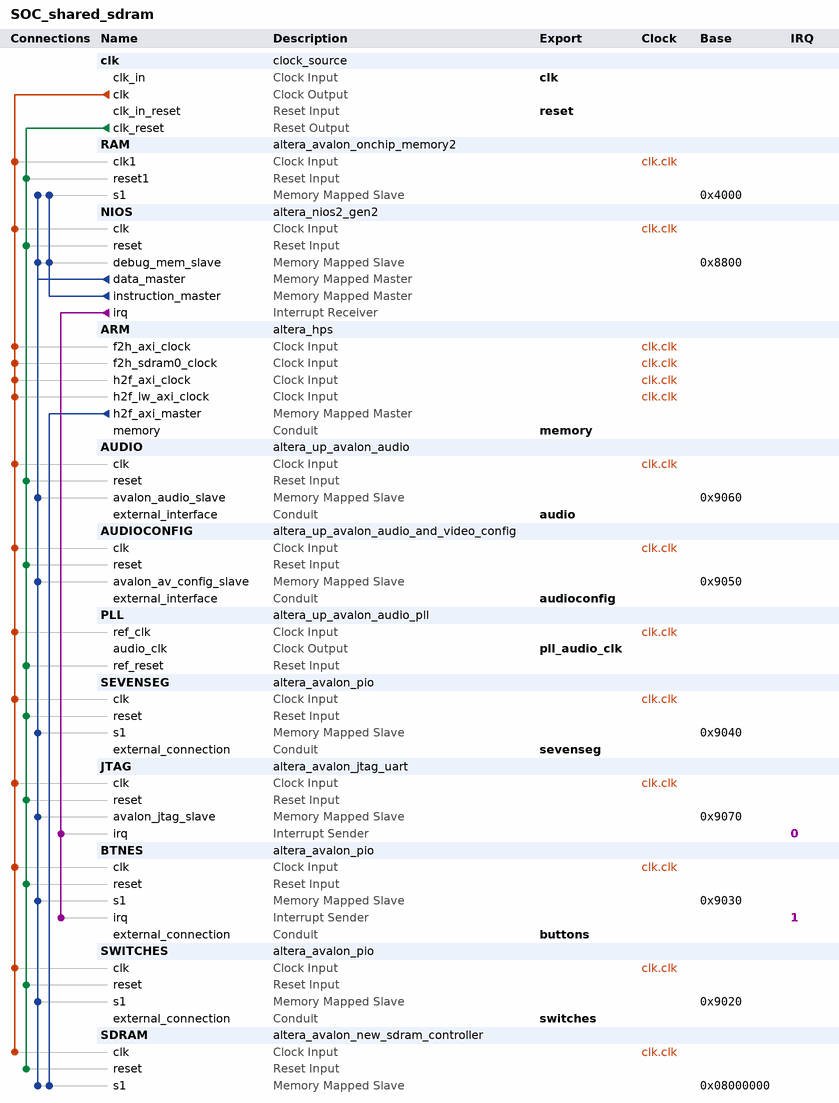
[diagram p0: system contents]
# Platform Designer (Qsys) system SOC_shared_sdram, Cyclone V 5CSEMA5F31C6
# Parameters at their usual value, and those the tool derives, are not listed.
package require -exact qsys 18.1
create_system SOC_shared_sdram
set_project_property DEVICE_FAMILY {Cyclone V}
set_project_property DEVICE 5CSEMA5F31C6

add_instance clk clock_source 18.1
set_instance_parameter_value clk clockFrequency 50000000

add_instance RAM altera_avalon_onchip_memory2 18.1
set_instance_parameter_value RAM dataWidth 32
set_instance_parameter_value RAM dualPort false
set_instance_parameter_value RAM initMemContent true
set_instance_parameter_value RAM initializationFileName onchip_mem.hex
set_instance_parameter_value RAM memorySize 16384

add_instance NIOS altera_nios2_gen2 18.1
set_instance_parameter_value NIOS dcache_size 2048
set_instance_parameter_value NIOS exceptionSlave RAM.s1
set_instance_parameter_value NIOS icache_size 4096
set_instance_parameter_value NIOS impl Tiny
set_instance_parameter_value NIOS resetSlave RAM.s1

add_instance ARM altera_hps 18.1
set_instance_parameter_value ARM EMAC1_Mode N/A
set_instance_parameter_value ARM EMAC1_PinMuxing Unused
set_instance_parameter_value ARM F2SCLK_COLDRST_Enable false
set_instance_parameter_value ARM F2SCLK_DBGRST_Enable false
set_instance_parameter_value ARM F2SCLK_WARMRST_Enable false
set_instance_parameter_value ARM F2SDRAM_Type AXI-3
set_instance_parameter_value ARM F2SDRAM_Width 64
set_instance_parameter_value ARM F2SINTERRUPT_Enable false
set_instance_parameter_value ARM F2S_Width 2
set_instance_parameter_value ARM FPGA_PERIPHERAL_OUTPUT_CLOCK_FREQ_EMAC0_GTX_CLK 125
set_instance_parameter_value ARM FPGA_PERIPHERAL_OUTPUT_CLOCK_FREQ_EMAC0_MD_CLK 2.5
set_instance_parameter_value ARM FPGA_PERIPHERAL_OUTPUT_CLOCK_FREQ_EMAC1_GTX_CLK 125
set_instance_parameter_value ARM FPGA_PERIPHERAL_OUTPUT_CLOCK_FREQ_EMAC1_MD_CLK 2.5
set_instance_parameter_value ARM HPS_PROTOCOL DDR3
set_instance_parameter_value ARM I2C0_Mode N/A
set_instance_parameter_value ARM I2C0_PinMuxing Unused
set_instance_parameter_value ARM I2C1_Mode N/A
set_instance_parameter_value ARM I2C1_PinMuxing Unused
set_instance_parameter_value ARM LWH2F_Enable true
set_instance_parameter_value ARM MEM_BANKADDR_WIDTH 3
set_instance_parameter_value ARM MEM_CLK_FREQ 300.0
set_instance_parameter_value ARM MEM_CLK_FREQ_MAX 400.0
set_instance_parameter_value ARM MEM_COL_ADDR_WIDTH 8
set_instance_parameter_value ARM MEM_DQ_WIDTH 8
set_instance_parameter_value ARM MEM_DRV_STR RZQ/6
set_instance_parameter_value ARM MEM_ROW_ADDR_WIDTH 12
set_instance_parameter_value ARM MEM_RTT_NOM {ODT Disabled}
set_instance_parameter_value ARM MEM_RTT_WR {Dynamic ODT off}
set_instance_parameter_value ARM MEM_TCL 7
set_instance_parameter_value ARM MEM_TFAW_NS 37.5
set_instance_parameter_value ARM MEM_TINIT_US 499
set_instance_parameter_value ARM MEM_TMRD_CK 3
set_instance_parameter_value ARM MEM_TRAS_NS 40.0
set_instance_parameter_value ARM MEM_TRCD_NS 15.0
set_instance_parameter_value ARM MEM_TREFI_US 7.0
set_instance_parameter_value ARM MEM_TRFC_NS 75.0
set_instance_parameter_value ARM MEM_TRP_NS 15.0
set_instance_parameter_value ARM MEM_TWTR 2
set_instance_parameter_value ARM MEM_VENDOR JEDEC
set_instance_parameter_value ARM MEM_WTCL 6
set_instance_parameter_value ARM MPU_EVENTS_Enable true
set_instance_parameter_value ARM QSPI_Mode N/A
set_instance_parameter_value ARM QSPI_PinMuxing Unused
set_instance_parameter_value ARM REF_CLK_FREQ 125.0
set_instance_parameter_value ARM S2FCLK_USER2CLK 5
set_instance_parameter_value ARM S2F_Width 2
set_instance_parameter_value ARM SDIO_Mode N/A
set_instance_parameter_value ARM SDIO_PinMuxing Unused
set_instance_parameter_value ARM SPIM1_Mode N/A
set_instance_parameter_value ARM SPIM1_PinMuxing Unused
set_instance_parameter_value ARM STM_Enable false
set_instance_parameter_value ARM TIMING_BOARD_AC_SKEW 0.02
set_instance_parameter_value ARM TIMING_BOARD_AC_TO_CK_SKEW 0.0
set_instance_parameter_value ARM TIMING_BOARD_DQ_TO_DQS_SKEW 0.0
set_instance_parameter_value ARM TIMING_BOARD_MAX_CK_DELAY 0.6
set_instance_parameter_value ARM TIMING_BOARD_MAX_DQS_DELAY 0.6
set_instance_parameter_value ARM TIMING_BOARD_SKEW_BETWEEN_DQS 0.02
set_instance_parameter_value ARM TIMING_BOARD_SKEW_CKDQS_DIMM_MAX 0.01
set_instance_parameter_value ARM TIMING_BOARD_SKEW_CKDQS_DIMM_MIN -0.01
set_instance_parameter_value ARM TIMING_BOARD_SKEW_WITHIN_DQS 0.02
set_instance_parameter_value ARM TIMING_TDH 125
set_instance_parameter_value ARM TIMING_TDQSCK 400
set_instance_parameter_value ARM TIMING_TDQSQ 120
set_instance_parameter_value ARM TIMING_TDS 50
set_instance_parameter_value ARM TIMING_TIH 250
set_instance_parameter_value ARM TIMING_TIS 175
set_instance_parameter_value ARM TIMING_TQSH 0.38
set_instance_parameter_value ARM UART0_Mode N/A
set_instance_parameter_value ARM UART0_PinMuxing Unused
set_instance_parameter_value ARM USB1_Mode N/A
set_instance_parameter_value ARM USB1_PinMuxing Unused
set_instance_parameter_value ARM desired_cfg_clk_mhz 100.0
set_instance_parameter_value ARM desired_qspi_clk_mhz 400.0

add_instance AUDIO altera_up_avalon_audio 18.0
set_instance_parameter_value AUDIO audio_in true
set_instance_parameter_value AUDIO avalon_bus_type {Memory Mapped}
set_instance_parameter_value AUDIO dw 32

add_instance AUDIOCONFIG altera_up_avalon_audio_and_video_config 18.0
set_instance_parameter_value AUDIOCONFIG audio_in {Microphone to ADC}
set_instance_parameter_value AUDIOCONFIG bit_length 32
set_instance_parameter_value AUDIOCONFIG board DE1-SoC
set_instance_parameter_value AUDIOCONFIG line_in_bypass false
set_instance_parameter_value AUDIOCONFIG sampling_rate {48 kHz}

add_instance PLL altera_up_avalon_audio_pll 18.0
set_instance_parameter_value PLL audio_clk_freq 18.432
set_instance_parameter_value PLL gui_refclk 50.0

add_instance SEVENSEG altera_avalon_pio 18.1
set_instance_parameter_value SEVENSEG direction Output
set_instance_parameter_value SEVENSEG width 28

add_instance JTAG altera_avalon_jtag_uart 18.1
set_instance_parameter_value JTAG simInteractiveOptions NO_INTERACTIVE_WINDOWS

add_instance BTNES altera_avalon_pio 18.1
set_instance_parameter_value BTNES direction Input
set_instance_parameter_value BTNES generateIRQ true
set_instance_parameter_value BTNES width 3

add_instance SWITCHES altera_avalon_pio 18.1
set_instance_parameter_value SWITCHES direction Input
set_instance_parameter_value SWITCHES width 3

add_instance SDRAM altera_avalon_new_sdram_controller 18.1

# connections
add_connection clk.clk ARM.f2h_axi_clock clock
add_connection clk.clk ARM.f2h_sdram0_clock clock
add_connection clk.clk ARM.h2f_axi_clock clock
add_connection clk.clk ARM.h2f_lw_axi_clock clock
add_connection clk.clk AUDIO.clk clock
add_connection clk.clk AUDIOCONFIG.clk clock
add_connection clk.clk BTNES.clk clock
add_connection clk.clk JTAG.clk clock
add_connection clk.clk NIOS.clk clock
add_connection clk.clk PLL.ref_clk clock
add_connection clk.clk RAM.clk1 clock
add_connection clk.clk SDRAM.clk clock
add_connection clk.clk SEVENSEG.clk clock
add_connection clk.clk SWITCHES.clk clock
add_connection clk.clk_reset AUDIO.reset reset
add_connection clk.clk_reset AUDIOCONFIG.reset reset
add_connection clk.clk_reset BTNES.reset reset
add_connection clk.clk_reset JTAG.reset reset
add_connection clk.clk_reset NIOS.reset reset
add_connection clk.clk_reset PLL.ref_reset reset
add_connection clk.clk_reset RAM.reset1 reset
add_connection clk.clk_reset SDRAM.reset reset
add_connection clk.clk_reset SEVENSEG.reset reset
add_connection clk.clk_reset SWITCHES.reset reset
add_connection ARM.h2f_axi_master SDRAM.s1 avalon
set_connection_parameter_value ARM.h2f_axi_master/SDRAM.s1 baseAddress 0x08000000
add_connection NIOS.data_master AUDIO.avalon_audio_slave avalon
set_connection_parameter_value NIOS.data_master/AUDIO.avalon_audio_slave baseAddress 0x9060
add_connection NIOS.data_master AUDIOCONFIG.avalon_av_config_slave avalon
set_connection_parameter_value NIOS.data_master/AUDIOCONFIG.avalon_av_config_slave baseAddress 0x9050
add_connection NIOS.data_master BTNES.s1 avalon
set_connection_parameter_value NIOS.data_master/BTNES.s1 baseAddress 0x9030
add_connection NIOS.data_master JTAG.avalon_jtag_slave avalon
set_connection_parameter_value NIOS.data_master/JTAG.avalon_jtag_slave baseAddress 0x9070
add_connection NIOS.data_master NIOS.debug_mem_slave avalon
set_connection_parameter_value NIOS.data_master/NIOS.debug_mem_slave baseAddress 0x8800
add_connection NIOS.data_master RAM.s1 avalon
set_connection_parameter_value NIOS.data_master/RAM.s1 baseAddress 0x4000
add_connection NIOS.data_master SDRAM.s1 avalon
set_connection_parameter_value NIOS.data_master/SDRAM.s1 baseAddress 0x08000000
add_connection NIOS.data_master SEVENSEG.s1 avalon
set_connection_parameter_value NIOS.data_master/SEVENSEG.s1 baseAddress 0x9040
add_connection NIOS.data_master SWITCHES.s1 avalon
set_connection_parameter_value NIOS.data_master/SWITCHES.s1 baseAddress 0x9020
add_connection NIOS.instruction_master NIOS.debug_mem_slave avalon
set_connection_parameter_value NIOS.instruction_master/NIOS.debug_mem_slave baseAddress 0x8800
add_connection NIOS.instruction_master RAM.s1 avalon
set_connection_parameter_value NIOS.instruction_master/RAM.s1 baseAddress 0x4000
add_connection NIOS.irq BTNES.irq interrupt
set_connection_parameter_value NIOS.irq/BTNES.irq irqNumber 1
add_connection NIOS.irq JTAG.irq interrupt
set_connection_parameter_value NIOS.irq/JTAG.irq irqNumber 0

# exported interfaces
add_interface audio conduit end
set_interface_property audio EXPORT_OF AUDIO.external_interface
add_interface audioconfig conduit end
set_interface_property audioconfig EXPORT_OF AUDIOCONFIG.external_interface
add_interface buttons conduit end
set_interface_property buttons EXPORT_OF BTNES.external_connection
add_interface clk clock sink
set_interface_property clk EXPORT_OF clk.clk_in
add_interface memory conduit end
set_interface_property memory EXPORT_OF ARM.memory
add_interface pll_audio_clk clock source
set_interface_property pll_audio_clk EXPORT_OF PLL.audio_clk
add_interface reset reset sink
set_interface_property reset EXPORT_OF clk.clk_in_reset
add_interface sevenseg conduit end
set_interface_property sevenseg EXPORT_OF SEVENSEG.external_connection
add_interface switches conduit end
set_interface_property switches EXPORT_OF SWITCHES.external_connection

set_interconnect_requirement {$system} qsys_mm.clockCrossingAdapter HANDSHAKE
set_interconnect_requirement {$system} qsys_mm.enableEccProtection FALSE
set_interconnect_requirement {$system} qsys_mm.insertDefaultSlave FALSE
set_interconnect_requirement {$system} qsys_mm.maxAdditionalLatency 1

save_system SOC_shared_sdram.qsys
